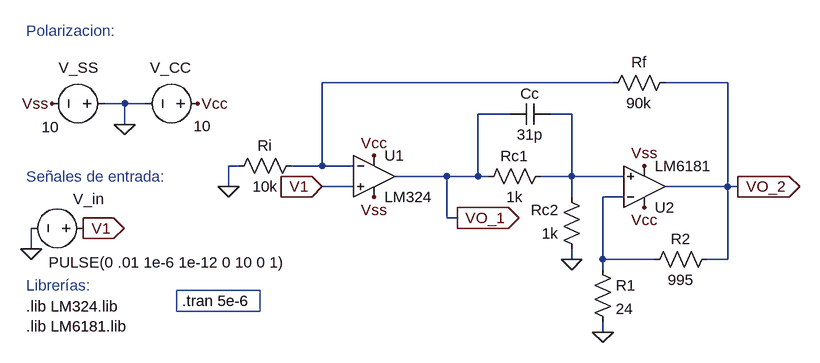
[diagram p0: schematic Lab_3_Circ_3-Respuesta al escalon.asc]
Lab_3_Circ_3-Respuesta al escalon.asc, the LTspice schematic file:
Version 4
SHEET 1 1652 680
WIRE 784 -288 336 -288
WIRE 960 -288 864 -288
WIRE 32 -256 0 -256
WIRE 64 -256 32 -256
WIRE 624 -240 576 -240
WIRE 720 -240 688 -240
WIRE 32 -224 32 -256
WIRE 208 -160 192 -160
WIRE 336 -160 336 -288
WIRE 336 -160 288 -160
WIRE 384 -160 336 -160
WIRE 528 -144 448 -144
WIRE 576 -144 576 -240
WIRE 576 -144 528 -144
WIRE 592 -144 576 -144
WIRE 720 -144 720 -240
WIRE 720 -144 672 -144
WIRE 800 -144 720 -144
WIRE 192 -128 192 -160
WIRE 384 -128 336 -128
WIRE 960 -128 960 -288
WIRE 960 -128 864 -128
WIRE 976 -128 960 -128
WIRE 720 -112 720 -144
WIRE 800 -112 768 -112
WIRE 528 -80 528 -144
WIRE 544 -80 528 -80
WIRE -112 -32 -112 -64
WIRE 720 -16 720 -32
WIRE 768 -16 768 -112
WIRE 848 -16 768 -16
WIRE 960 -16 960 -128
WIRE 960 -16 928 -16
WIRE 768 0 768 -16
WIRE 768 96 768 80
FLAG 768 96 0
FLAG 144 -256 Vcc
FLAG 416 -176 Vcc
FLAG -80 -256 Vss
FLAG 416 -112 Vss
FLAG 32 -224 0
FLAG 336 -128 V1
IOPIN 336 -128 In
FLAG 976 -128 VO_2
IOPIN 976 -128 Out
FLAG 832 -96 Vcc
FLAG 832 -160 Vss
FLAG 192 -128 0
FLAG 544 -80 VO_1
IOPIN 544 -80 Out
FLAG 720 -16 0
FLAG -112 -32 0
FLAG -32 -64 V1
IOPIN -32 -64 Out
SYMBOL OpAmps\\opamp2 416 -208 R0
SYMATTR InstName U1
SYMATTR Value LM324
SYMBOL res 752 -16 R0
SYMATTR InstName R1
SYMATTR Value 24
SYMBOL res 832 0 R270
WINDOW 0 32 56 VTop 2
WINDOW 3 0 56 VBottom 2
SYMATTR InstName R2
SYMATTR Value 995
SYMBOL res 880 -304 R90
WINDOW 0 0 56 VBottom 2
WINDOW 3 32 56 VTop 2
SYMATTR InstName Rf
SYMATTR Value 90k
SYMBOL res 192 -144 R270
WINDOW 0 32 56 VTop 2
WINDOW 3 0 56 VBottom 2
SYMATTR InstName Ri
SYMATTR Value 10k
SYMBOL voltage 160 -256 R90
WINDOW 0 -55 25 VRight 2
WINDOW 3 35 -5 VRight 2
WINDOW 123 0 0 Left 0
WINDOW 39 0 0 Left 0
SYMATTR InstName V_CC
SYMATTR Value 10
SYMBOL voltage 16 -256 R90
WINDOW 0 -55 25 VRight 2
WINDOW 3 36 85 VRight 2
WINDOW 123 0 0 Left 0
WINDOW 39 0 0 Left 0
SYMATTR InstName V_SS
SYMATTR Value 10
SYMBOL OpAmps\\opamp2 832 -64 M180
SYMATTR InstName U2
SYMATTR Value LM6181
SYMBOL res 688 -160 R90
WINDOW 0 0 56 VBottom 2
WINDOW 3 32 56 VTop 2
SYMATTR InstName Rc1
SYMATTR Value 1k
SYMBOL res 736 -16 R180
WINDOW 0 36 76 Left 2
WINDOW 3 36 40 Left 2
SYMATTR InstName Rc2
SYMATTR Value 1k
SYMBOL cap 688 -256 R90
WINDOW 0 0 32 VBottom 2
WINDOW 3 32 32 VTop 2
SYMATTR InstName Cc
SYMATTR Value 31p
SYMBOL voltage -16 -64 M270
WINDOW 0 45 31 VLeft 2
WINDOW 3 -53 69 VLeft 2
WINDOW 123 -1 -56 VLeft 2
WINDOW 39 0 0 Left 0
SYMATTR InstName V_in
SYMATTR Value PULSE(0 .01 1e-6 1e-12 0 10 0 1)
TEXT -120 56 Left 2 !.lib LM324.lib\n.lib LM6181.lib
TEXT -120 24 Left 2 ;Librerías:
TEXT -120 -368 Left 2 ;Polarizacion:
TEXT -120 -144 Left 2 ;Señales de entrada:
TEXT 120 48 Left 2 !.tran 5e-6
RECTANGLE Normal 240 64 112 32

The netlist it stands for:
* Lab_3_Circ_3-Respuesta al escalon.asc
XU1 V1 N001 Vcc Vss VO_1 LM324  ; pins In+ In- V+ V- OUT
R1 N003 0 24
R2 N003 VO_2 995
Rf VO_2 N001 90k
Ri 0 N001 10k
V_CC Vcc 0 10
V_SS 0 Vss 10
XU2 N002 N003 Vcc Vss VO_2 LM6181  ; pins In+ In- V+ V- OUT
Rc1 N002 VO_1 1k
Rc2 0 N002 1k
Cc N002 VO_1 31p
V_in V1 0 PULSE(0 .01 1e-6 1e-12 0 10 0 1)
.lib LM324.lib
.lib LM6181.lib
* Librerías:
* Polarizacion:
* Señales de entrada:
.tran 5e-6
.backanno
.end